# EAGLE design romboard (EAGLE 7.5.0)
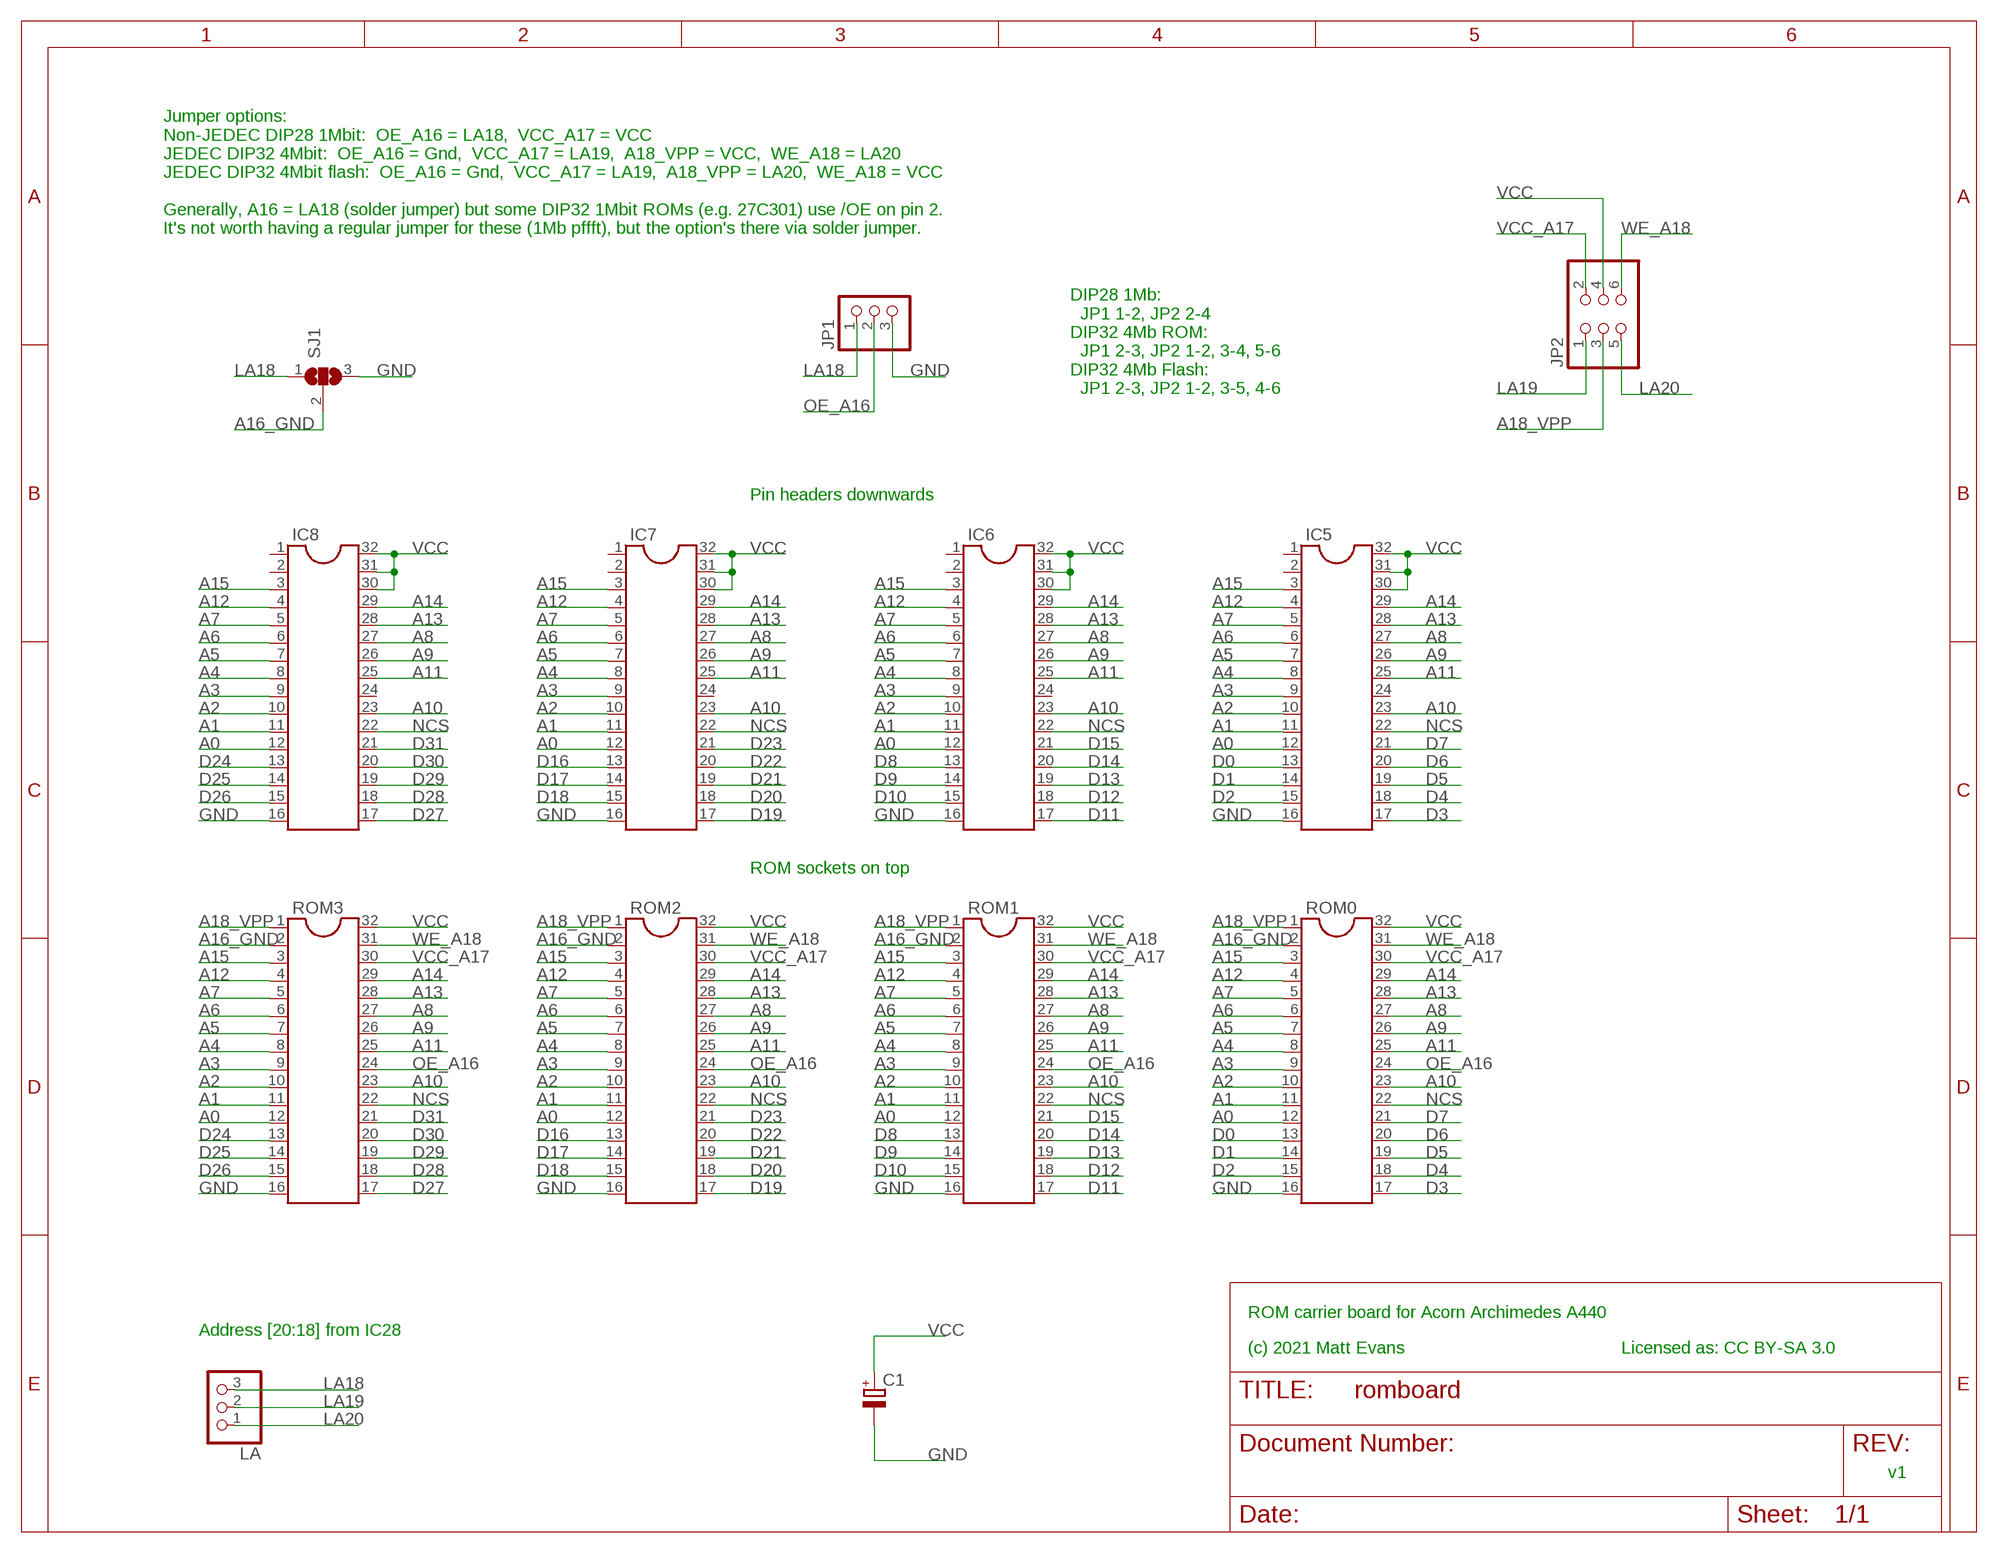
[diagram p0: schematic, sheet 1]

## Parts
C1  CPOL-EU085CS-1AR  [085CS_1AR]
IC5  DIL32  [DIL32]
IC6  DIL32  [DIL32]
IC7  DIL32  [DIL32]
IC8  DIL32  [DIL32]
JP1  PINHD-1X3  [1X03]
JP2  PINHD-2X3  [2X03]
LA  PINHD-1X3/90  [1X03/90]
ROM0  DIL32  [DIL32]
ROM1  DIL32  [DIL32]
ROM2  DIL32  [DIL32]
ROM3  DIL32  [DIL32]
SJ1  SJ2W  [SJ_2]

## Nets
A0: IC5.12 IC6.12 IC7.12 IC8.12 ROM0.12 ROM1.12 ROM2.12 ROM3.12
A1: IC5.11 IC6.11 IC7.11 IC8.11 ROM0.11 ROM1.11 ROM2.11 ROM3.11
A2: IC5.10 IC6.10 IC7.10 IC8.10 ROM0.10 ROM1.10 ROM2.10 ROM3.10
A3: IC5.9 IC6.9 IC7.9 IC8.9 ROM0.9 ROM1.9 ROM2.9 ROM3.9
A4: IC5.8 IC6.8 IC7.8 IC8.8 ROM0.8 ROM1.8 ROM2.8 ROM3.8
A5: IC5.7 IC6.7 IC7.7 IC8.7 ROM0.7 ROM1.7 ROM2.7 ROM3.7
A6: IC5.6 IC6.6 IC7.6 IC8.6 ROM0.6 ROM1.6 ROM2.6 ROM3.6
A7: IC5.5 IC6.5 IC7.5 IC8.5 ROM0.5 ROM1.5 ROM2.5 ROM3.5
A8: IC5.27 IC6.27 IC7.27 IC8.27 ROM0.27 ROM1.27 ROM2.27 ROM3.27
A9: IC5.26 IC6.26 IC7.26 IC8.26 ROM0.26 ROM1.26 ROM2.26 ROM3.26
A10: IC5.23 IC6.23 IC7.23 IC8.23 ROM0.23 ROM1.23 ROM2.23 ROM3.23
A11: IC5.25 IC6.25 IC7.25 IC8.25 ROM0.25 ROM1.25 ROM2.25 ROM3.25
A12: IC5.4 IC6.4 IC7.4 IC8.4 ROM0.4 ROM1.4 ROM2.4 ROM3.4
A13: IC5.28 IC6.28 IC7.28 IC8.28 ROM0.28 ROM1.28 ROM2.28 ROM3.28
A14: IC5.29 IC6.29 IC7.29 IC8.29 ROM0.29 ROM1.29 ROM2.29 ROM3.29
A15: IC5.3 IC6.3 IC7.3 IC8.3 ROM0.3 ROM1.3 ROM2.3 ROM3.3
A16_GND: ROM0.2 ROM1.2 ROM2.2 ROM3.2 SJ1.2
A18_VPP: JP2.3 ROM0.1 ROM1.1 ROM2.1 ROM3.1
D0: IC5.13 ROM0.13
D1: IC5.14 ROM0.14
D2: IC5.15 ROM0.15
D3: IC5.17 ROM0.17
D4: IC5.18 ROM0.18
D5: IC5.19 ROM0.19
D6: IC5.20 ROM0.20
D7: IC5.21 ROM0.21
D8: IC6.13 ROM1.13
D9: IC6.14 ROM1.14
D10: IC6.15 ROM1.15
D11: IC6.17 ROM1.17
D12: IC6.18 ROM1.18
D13: IC6.19 ROM1.19
D14: IC6.20 ROM1.20
D15: IC6.21 ROM1.21
D16: IC7.13 ROM2.13
D17: IC7.14 ROM2.14
D18: IC7.15 ROM2.15
D19: IC7.17 ROM2.17
D20: IC7.18 ROM2.18
D21: IC7.19 ROM2.19
D22: IC7.20 ROM2.20
D23: IC7.21 ROM2.21
D24: IC8.13 ROM3.13
D25: IC8.14 ROM3.14
D26: IC8.15 ROM3.15
D27: IC8.17 ROM3.17
D28: IC8.18 ROM3.18
D29: IC8.19 ROM3.19
D30: IC8.20 ROM3.20
D31: IC8.21 ROM3.21
GND: C1.- IC5.16 IC6.16 IC7.16 IC8.16 JP1.3 ROM0.16 ROM1.16 ROM2.16 ROM3.16 SJ1.3
LA18: JP1.1 LA.3 SJ1.1
LA19: JP2.1 LA.2
LA20: JP2.5 LA.1
NCS: IC5.22 IC6.22 IC7.22 IC8.22 ROM0.22 ROM1.22 ROM2.22 ROM3.22
OE_A16: JP1.2 ROM0.24 ROM1.24 ROM2.24 ROM3.24
VCC: C1.+ IC5.30 IC5.31 IC5.32 IC6.30 IC6.31 IC6.32 IC7.30 IC7.31 IC7.32 IC8.30 IC8.31 IC8.32 JP2.4 ROM0.32 ROM1.32 ROM2.32 ROM3.32
VCC_A17: JP2.2 ROM0.30 ROM1.30 ROM2.30 ROM3.30
WE_A18: JP2.6 ROM0.31 ROM1.31 ROM2.31 ROM3.31
Unconnected: IC5.1 IC5.2 IC5.24 IC6.1 IC6.2 IC6.24 IC7.1 IC7.2 IC7.24 IC8.1 IC8.2 IC8.24

## Notes on the sheet
- Jumper options:
  Non-JEDEC DIP28 1Mbit:  OE_A16 = LA18,  VCC_A17 = VCC
  JEDEC DIP32 4Mbit:  OE_A16 = Gnd,  VCC_A17 = LA19,  A18_VPP = VCC,  WE_A18 = LA20
  JEDEC DIP32 4Mbit flash:  OE_A16 = Gnd,  VCC_A17 = LA19,  A18_VPP = LA20,  WE_A18 = VCC
  
  Generally, A16 = LA18 (solder jumper) but some DIP32 1Mbit ROMs (e.g. 27C301) use /OE on pin 2.
  It's not worth having a regular jumper for these (1Mb pffft), but the option's there via solder jumper.
- DIP28 1Mb:
    JP1 1-2, JP2 2-4
  DIP32 4Mb ROM:
    JP1 2-3, JP2 1-2, 3-4, 5-6
  DIP32 4Mb Flash:
    JP1 2-3, JP2 1-2, 3-5, 4-6
- Pin headers downwards
- ROM sockets on top
- ROM carrier board for Acorn Archimedes A440
- Address [20:18] from IC28
- (c) 2021 Matt Evans | Licensed as: CC BY-SA 3.0
- v1

## Library data of the parts
C1 = rcl:CPOL-EU: POLARIZED CAPACITOR, European symbol
IC5-IC8 ROM0 ROM1-ROM3 = matt:DIL32: Dual In Line
JP1 = matt:PINHD-1X3: PIN HEADER
JP2 = matt:PINHD-2X3: PIN HEADER
LA = pinhead:PINHD-1X3: PIN HEADER
SJ1 = jumper:SJ2W: SMD solder JUMPER

## Board
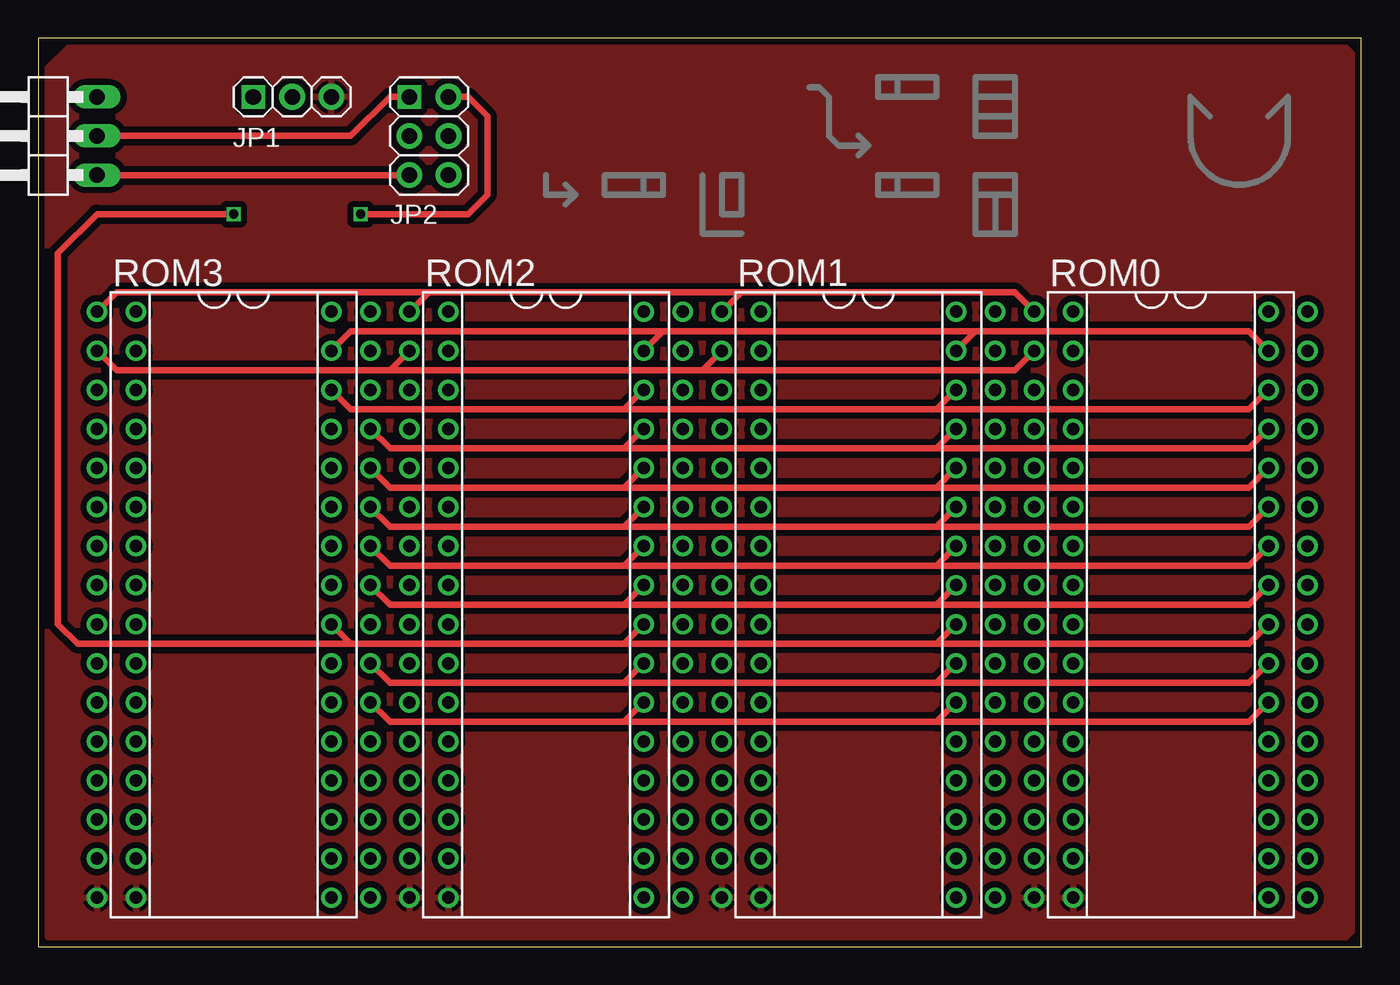
[diagram p1: board, top side]
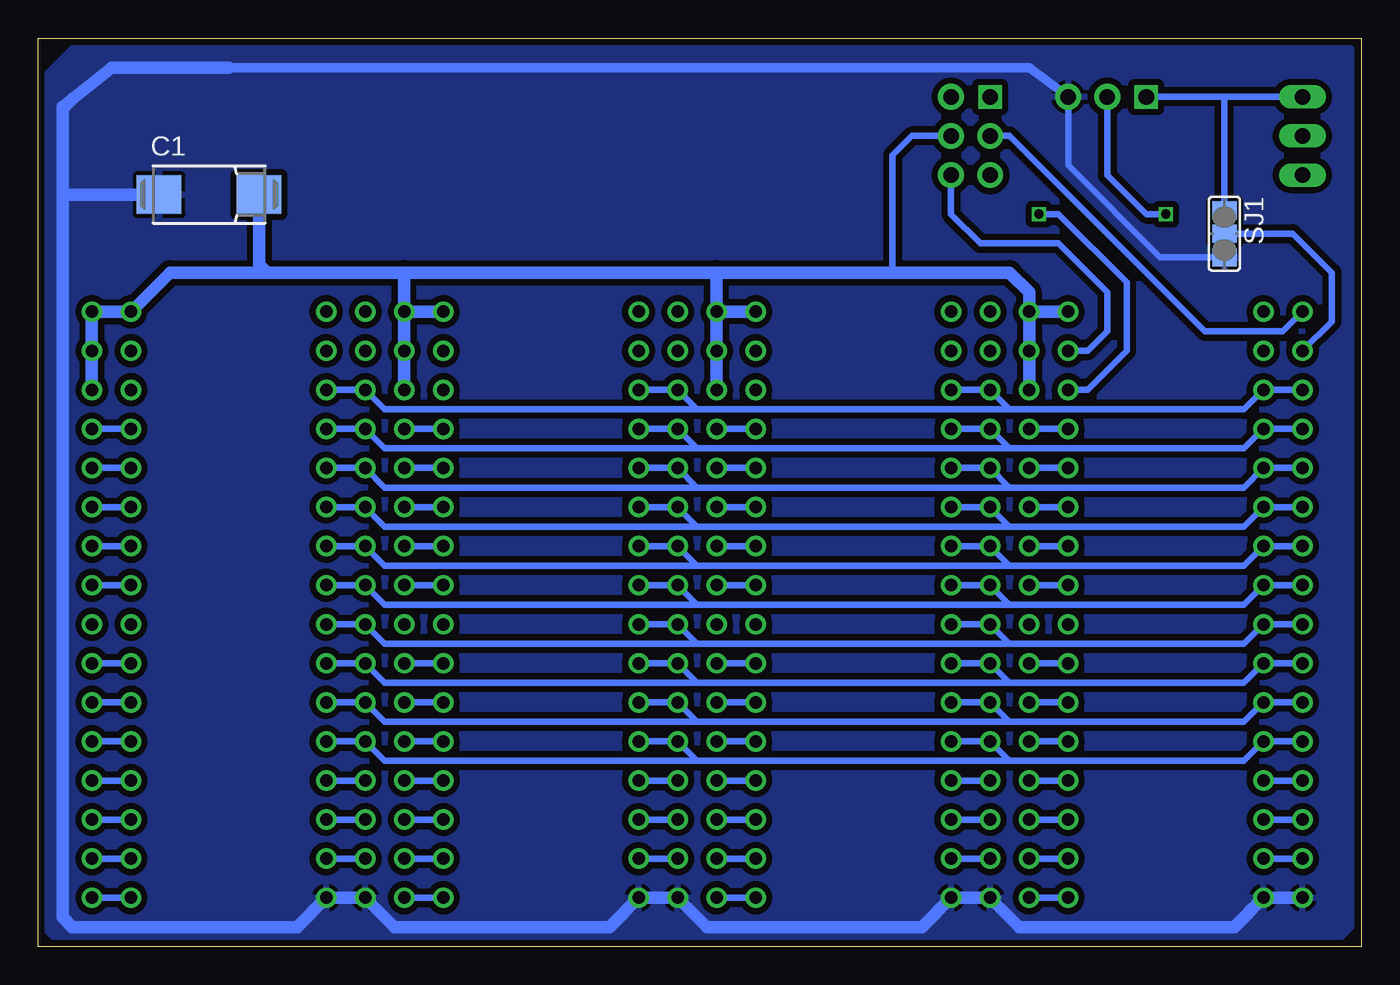
[diagram p2: board, bottom side, seen from below]

Size 86.03 x 59.04 mm. Coordinates in mm from the lower left corner, seen from the top.
Outline: 0,0 86.03,0 86.03,59.04 0,59.04 0,0
Copper layers (1*16): Top 0.035mm / dielectric 1.5mm / Bottom 0.035mm
Design rules "SeeedStudio_2layer_DRU_no_angle_20140221": minimum track width 6mil, minimum drill 12mil, track to track 6mil, track to pad 6mil, pad to pad 6mil, via to via 6mil, smd to smd 0mil, copper to edge 10mil, drill to drill 10mil, minimum pad ring 10mil, minimum via ring 6mil, stop-mask expansion 2mil, vias tented up to drill 100mil, thermal gap 10mil

### Footprints (pad centres in the part's own frame; a part is rotated, then mirrored left to right if it is on the bottom)
085CS_1AR = smd 2.9 x 2.5: + 3.25,0; - -3.25,0
DIL32 = drill 0.813: 1 -19.05,-7.62; 2 -16.51,-7.62; 3 -13.97,-7.62; 4 -11.43,-7.62; 5 -8.89,-7.62; 6 -6.35,-7.62; 7 -3.81,-7.62; 8 -1.27,-7.62; 9 1.27,-7.62; 10 3.81,-7.62; 11 6.35,-7.62; 12 8.89,-7.62; 13 11.43,-7.62; 14 13.97,-7.62; 15 16.51,-7.62; 16 19.05,-7.62; 17 19.05,7.62; 18 16.51,7.62; 19 13.97,7.62; 20 11.43,7.62; 21 8.89,7.62; 22 6.35,7.62; 23 3.81,7.62; 24 1.27,7.62; 25 -1.27,7.62; 26 -3.81,7.62; 27 -6.35,7.62; 28 -8.89,7.62; 29 -11.43,7.62; 30 -13.97,7.62; 31 -16.51,7.62; 32 -19.05,7.62
1X03 = drill 1.016 square: 1 -2.54,0 | drill 1.016 pad 1.676: 2 0,0; 3 2.54,0
2X03 = drill 1.016 square: 1 -2.54,-1.27 | drill 1.016 pad 1.676: 2 -2.54,1.27; 3 0,-1.27; 4 0,1.27; 5 2.54,-1.27; 6 2.54,1.27
1X03/90 = drill 1.016 long: 1 -2.54,-3.81; 2 0,-3.81; 3 2.54,-3.81
SJ_2 = smd 1.168 x 1.6: 1 -1.524,0; 2 0,0; 3 1.524,0

### Placement (x,y rotation side)
C1  74.93,48.89 0 bottom
IC5  74.93,22.23 270 top
IC6  54.61,22.23 270 top
IC7  34.29,22.23 270 top
IC8  13.97,22.23 270 top
JP1  16.51,55.24 0 top
JP2  25.4,52.7 270 top
LA  0,52.7 90 top
ROM0  72.39,22.23 270 top
ROM1  52.07,22.23 270 top
ROM2  31.75,22.23 270 top
ROM3  11.43,22.23 270 top
SJ1  8.89,46.35 270 bottom

### Tracks (layer width: path | path; a pad name or v marks a point on that pad's centre or on a via)
A0
  Bottom 0.406: ROM3.12 IC8.12 7.62,12.06 22.86,12.06 | IC7.12 ROM2.12 22.86,12.06 | IC5.12 ROM0.12 63.5,12.06 43.18,12.06 | 22.86,12.06 43.18,12.06 | IC6.12 ROM1.12 43.18,12.06
A1
  Bottom 0.406: ROM3.11 IC8.11 7.62,14.61 22.86,14.61 | IC7.11 ROM2.11 22.86,14.61 | IC5.11 ROM0.11 63.5,14.61 43.18,14.61 | 22.86,14.61 43.18,14.61 | IC6.11 ROM1.11 43.18,14.61
A2
  Bottom 0.406: ROM3.10 IC8.10 7.62,17.15 22.86,17.15 | IC7.10 ROM2.10 22.86,17.15 | IC5.10 ROM0.10 63.5,17.15 43.18,17.15 | 22.86,17.15 43.18,17.15 | IC6.10 ROM1.10 43.18,17.15
A3
  Bottom 0.406: ROM3.9 IC8.9 7.62,19.69 22.86,19.69 | IC7.9 ROM2.9 22.86,19.69 | IC5.9 ROM0.9 63.5,19.69 43.18,19.69 | 22.86,19.69 43.18,19.69 | IC6.9 ROM1.9 43.18,19.69
A4
  Bottom 0.406: ROM3.8 IC8.8 7.62,22.23 22.86,22.23 | IC7.8 ROM2.8 22.86,22.23 | IC5.8 ROM0.8 63.5,22.23 43.18,22.23 | 22.86,22.23 43.18,22.23 | IC6.8 ROM1.8 43.18,22.23
A5
  Bottom 0.406: ROM3.7 IC8.7 7.62,24.77 22.86,24.77 | IC7.7 ROM2.7 22.86,24.77 | IC5.7 ROM0.7 63.5,24.77 43.18,24.77 | 22.86,24.77 43.18,24.77 | IC6.7 ROM1.7 43.18,24.77
A6
  Bottom 0.406: ROM3.6 IC8.6 7.62,27.31 22.86,27.31 | IC5.6 ROM0.6 63.5,27.31 43.18,27.31 | 22.86,27.31 43.18,27.31 | IC6.6 ROM1.6 43.18,27.31 | IC7.6 ROM2.6 22.86,27.31
A7
  Bottom 0.406: ROM3.5 IC8.5 7.62,29.85 22.86,29.85 | IC5.5 ROM0.5 63.5,29.85 43.18,29.85 | 22.86,29.85 43.18,29.85 | IC6.5 ROM1.5 43.18,29.85 | IC7.5 ROM2.5 22.86,29.85
A8
  Top 0.406: IC8.27 22.86,27.31 38.1,27.31 | 38.1,27.31 ROM2.27 | ROM1.27 58.42,27.31 | 58.42,27.31 38.1,27.31 | ROM0.27 78.74,27.31 58.42,27.31
  Bottom 0.406: ROM3.27 IC8.27 | ROM2.27 IC7.27 | IC5.27 ROM0.27 | IC6.27 ROM1.27
A9
  Top 0.406: IC8.26 22.86,24.77 38.1,24.77 | 38.1,24.77 ROM2.26 | ROM1.26 58.42,24.77 | 58.42,24.77 38.1,24.77 | ROM0.26 78.74,24.77 58.42,24.77
  Bottom 0.406: ROM3.26 IC8.26 | ROM2.26 IC7.26 | IC5.26 ROM0.26 | IC6.26 ROM1.26
A10
  Top 0.406: IC8.23 22.86,17.15 38.1,17.15 | 38.1,17.15 ROM2.23 | ROM1.23 58.42,17.15 | 58.42,17.15 38.1,17.15 | ROM0.23 78.74,17.15 58.42,17.15
  Bottom 0.406: ROM3.23 IC8.23 | ROM2.23 IC7.23 | ROM1.23 IC6.23 | IC5.23 ROM0.23
A11
  Top 0.406: ROM0.25 78.74,22.23 58.42,22.23 | ROM1.25 58.42,22.23 | 58.42,22.23 38.1,22.23 | ROM2.25 38.1,22.23 | 38.1,22.23 22.86,22.23 IC8.25
  Bottom 0.406: ROM2.25 IC7.25 | IC8.25 ROM3.25 | IC6.25 ROM1.25 | IC5.25 ROM0.25
A12
  Bottom 0.406: ROM3.4 IC8.4 7.62,32.38 22.86,32.38 | IC5.4 ROM0.4 63.5,32.38 43.18,32.38 | 22.86,32.38 43.18,32.38 | IC6.4 ROM1.4 43.18,32.38 | IC7.4 ROM2.4 22.86,32.38
A13
  Top 0.406: IC8.28 22.86,29.85 38.1,29.85 | 38.1,29.85 ROM2.28 | ROM1.28 58.42,29.85 | 58.42,29.85 38.1,29.85 | ROM0.28 78.74,29.85 58.42,29.85
  Bottom 0.406: ROM3.28 IC8.28 | ROM2.28 IC7.28 | IC5.28 ROM0.28 | IC6.28 ROM1.28
A14
  Top 0.406: IC8.29 22.86,32.38 38.1,32.38 | 38.1,32.38 58.42,32.38 | 58.42,32.38 78.74,32.38 ROM0.29 | ROM2.29 38.1,32.38 | ROM1.29 58.42,32.38
  Bottom 0.406: IC7.29 ROM2.29 | IC5.29 ROM0.29 | IC8.29 ROM3.29 | ROM1.29 IC6.29
A15
  Bottom 0.406: ROM3.3 IC8.3 7.62,34.92 22.86,34.92 | IC7.3 ROM2.3 22.86,34.92 | IC5.3 ROM0.3 63.5,34.92 43.18,34.92 | 22.86,34.92 43.18,34.92 | IC6.3 ROM1.3 43.18,34.92
A16_GND
  Top 0.406: 43.18,37.46 63.5,37.46 ROM0.2 | 43.18,37.46 22.86,37.46 | 22.86,37.46 5.08,37.46 ROM3.2 | ROM1.2 43.18,37.46 | ROM2.2 22.86,37.46
  Bottom 0.406: ROM3.2 1.9,40.64 1.9,43.81 4.45,46.35 SJ1.2
A18_VPP
  Top 0.406: ROM0.1 63.5,42.54 45.72,42.54 | 45.72,42.54 ROM1.1 | ROM2.1 25.4,42.54 | 25.4,42.54 45.72,42.54 | 25.4,42.54 5.08,42.54 ROM3.1
  Bottom 0.406: JP2.3 22.86,52.7 10.16,40 5.08,40 ROM3.1
D0
  Bottom 0.406: IC5.13 ROM0.13
D1
  Bottom 0.406: ROM0.14 IC5.14
D2
  Bottom 0.406: ROM0.15 IC5.15
D3
  Bottom 0.406: ROM0.17 IC5.17
D4
  Bottom 0.406: IC5.18 ROM0.18
D5
  Bottom 0.406: ROM0.19 IC5.19
D6
  Bottom 0.406: IC5.20 ROM0.20
D7
  Bottom 0.406: ROM0.21 IC5.21
D8
  Bottom 0.406: IC6.13 ROM1.13
D9
  Bottom 0.406: IC6.14 ROM1.14
D10
  Bottom 0.406: IC6.15 ROM1.15
D11
  Bottom 0.406: IC6.17 ROM1.17
D12
  Bottom 0.406: ROM1.18 IC6.18
D13
  Bottom 0.406: IC6.19 ROM1.19
D14
  Bottom 0.406: ROM1.20 IC6.20
D15
  Bottom 0.406: IC6.21 ROM1.21
D16
  Bottom 0.406: IC7.13 ROM2.13
D17
  Bottom 0.406: IC7.14 ROM2.14
D18
  Bottom 0.406: IC7.15 ROM2.15
D19
  Bottom 0.406: ROM2.17 IC7.17
D20
  Bottom 0.406: ROM2.18 IC7.18
D21
  Bottom 0.406: ROM2.19 IC7.19
D22
  Bottom 0.406: ROM2.20 IC7.20
D23
  Bottom 0.406: ROM2.21 IC7.21
D24
  Bottom 0.406: ROM3.13 IC8.13
D25
  Bottom 0.406: ROM3.14 IC8.14
D26
  Bottom 0.406: ROM3.15 IC8.15
D27
  Bottom 0.406: ROM3.17 IC8.17
D28
  Bottom 0.406: ROM3.18 IC8.18
D29
  Bottom 0.406: ROM3.19 IC8.19
D30
  Bottom 0.406: ROM3.20 IC8.20
D31
  Bottom 0.406: ROM3.21 IC8.21
GND
  Bottom 0.406: JP1.3 19.05,50.8 13.08,44.83 SJ1.3
  Bottom 0.61: JP1.3 21.59,57.15 73.66,57.15
  Bottom 0.813: ROM3.16 IC8.16 8.26,1.27 22.23,1.27 ROM2.16 IC7.16 28.57,1.27 42.54,1.27 ROM1.16 IC6.16 48.89,1.27 62.87,1.27 ROM0.16 IC5.16 69.22,1.27 83.82,1.27 84.45,1.91 84.45,48.89 | 73.66,57.15 81.28,57.15 84.45,54.61 | 84.45,48.89 84.45,54.61 | 84.45,54.61 84.32,54.61 83.76,55.17 | C1.- 84.45,48.89
  pour Top (isolate 0.406): 0,56.52 2.54,59.05 84.45,59.05 85.73,57.78 85.73,1.27 84.45,0 1.27,0 0,1.27
  pour Bottom (isolate 0.406): 0.64,58.42 83.82,58.42 85.73,56.52 85.73,1.27 85.09,0.64 1.27,0.64 0.64,1.27
LA18
  Bottom 0.406: 8.89,55.24 LA.3 2.54,55.24 | 8.89,55.24 JP1.1 | SJ1.1 8.89,55.24
LA19
  Top 0.406: LA.2 20.32,52.7 22.86,55.24 JP2.1
LA20
  Top 0.406: LA.1 JP2.5
NCS
  Top 0.406: ROM0.22 78.74,14.61 58.42,14.61 | ROM1.22 58.42,14.61 | IC8.22 22.86,14.61 38.1,14.61 | 38.1,14.61 ROM2.22 | 58.42,14.61 38.1,14.61
  Bottom 0.406: ROM3.22 IC8.22 | ROM2.22 IC7.22 | IC6.22 ROM1.22 | IC5.22 ROM0.22
OE_A16  (via drill 0.6)
  Top 0.406: ROM3.24 20.32,19.69 | 20.32,19.69 38.1,19.69 | 38.1,19.69 ROM2.24 | ROM0.24 78.74,19.69 58.42,19.69 | 58.42,19.69 38.1,19.69 | ROM1.24 58.42,19.69 | 20.32,19.69 2.54,19.69 1.27,20.96 1.27,45.09 3.81,47.62 v12.7,47.62
  Bottom 0.406: JP1.2 16.51,50.16 13.97,47.62 v12.7,47.62
VCC
  Bottom 0.406: JP2.4 29.21,52.7 30.48,51.43 30.48,43.81
  Bottom 0.813: IC8.32 IC8.31 IC8.30 | IC7.32 IC7.31 IC7.30 | IC6.32 IC6.31 IC6.30 | IC5.30 IC5.31 IC5.32 ROM0.32 77.47,43.81 71.12,43.81 | IC6.32 ROM1.32 | IC8.32 ROM3.32 | 71.12,43.81 62.23,43.81 | 62.23,43.81 41.91,43.81 | 41.91,43.81 30.48,43.81 22.86,43.81 21.59,42.54 IC8.32 | IC6.32 62.23,43.81 | ROM2.32 IC7.32 | IC7.32 41.91,43.81 | C1.+ 71.68,44.38 71.12,43.81
VCC_A17  (via drill 0.6)
  Top 0.406: ROM0.30 78.74,34.92 58.42,34.92 | 58.42,34.92 38.1,34.92 | 38.1,34.92 20.32,34.92 ROM3.30 | ROM2.30 38.1,34.92 | ROM1.30 58.42,34.92 | v20.96,47.62 27.94,47.62 29.21,48.89 29.21,53.98 27.94,55.24 JP2.2
  Bottom 0.406: ROM3.30 17.78,36.2 15.24,38.73 15.24,43.18 19.68,47.62 v20.96,47.62
WE_A18
  Top 0.406: ROM0.31 78.74,40 60.96,40 | 60.96,40 40.64,40 | 40.64,40 20.32,40 ROM3.31 | ROM2.31 40.64,40 | ROM1.31 60.96,40
  Bottom 0.406: ROM3.31 17.78,38.73 16.51,40 16.51,42.54 19.68,45.72 24.77,45.72 26.67,47.62 JP2.6

### Text on the board
tDocu: 4Mb DIP32 | ROM | 1Mb DIP28 | LA / 18 / 19 / 20 | Flash | CC BY-SA 3.0 | Arc ROM carrier v1 | (c) 2021 Matt Evans